# EasyEDA schematic SCH_train-system-design_2026-06-14.json
TITLE: Sheet_2; REV: 1.0; Date: 2026-06-10; Sheet: 1/1; Drawn By: tushar_kherde; Company: Your Company
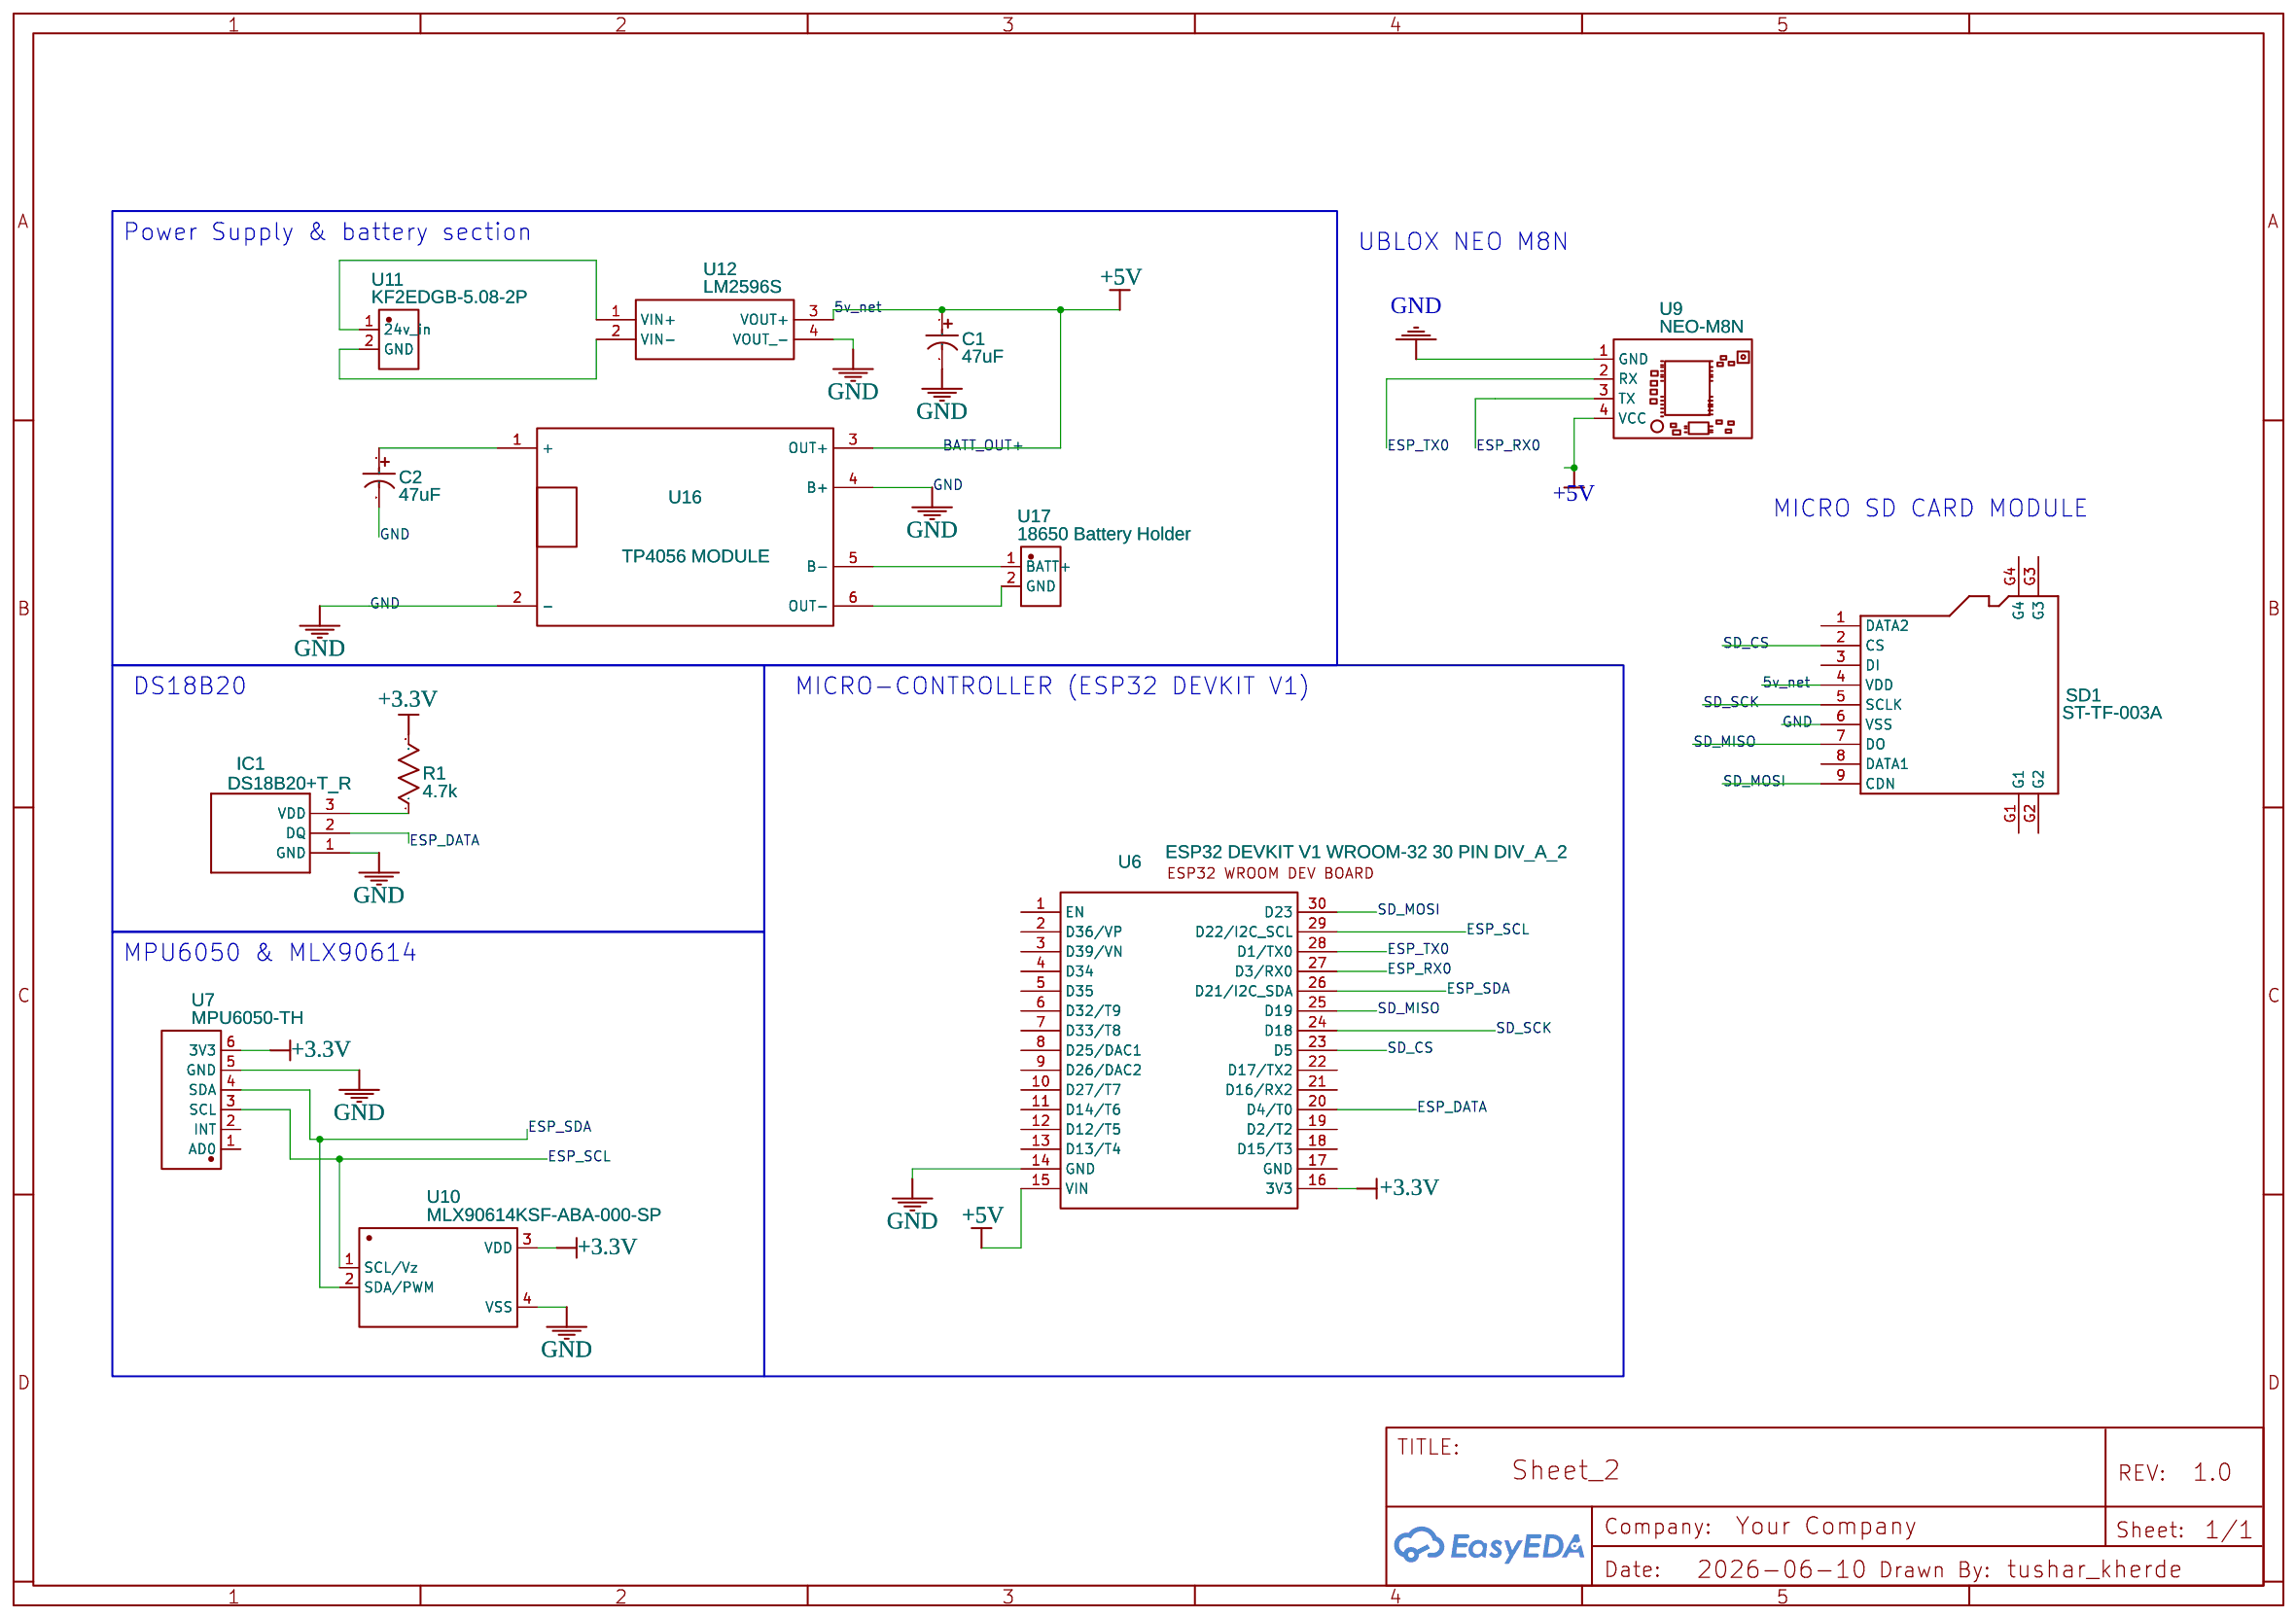
[diagram p0: schematic sheet]

## Parts
C1  47uF  [CAP-TH_BD5.0-P2.00-D0.8-FD]
C2  47uF  [CAP-TH_BD5.0-P2.00-D0.8-FD]
IC1  DS18B20+T_R  [DS18B20TR]
R1  4.7k  [R0603]
SD1  ST-TF-003A  [MICRO-SD9+4P-SMD-16.1X14.5X1.85MM]
U6  ESP32 DEVKIT V1 WROOM-32 30 PIN DIV_A_2  [ESP32 DEVKIT V1 30 PIN]
U7  MPU6050-TH  [COMM-TH_MPU6050-TH]
U9  NEO-M8N  [UBLOX-NEO-M8N]
U10  MLX90614KSF-ABA-000-SP  [TO-39-4_MELEXIS_MLX90614XXA]
U11  KF2EDGB-5.08-2P  [CONN-TH_KF2EDGB-5.08-2P_1]
U12  LM2596S  [LM2596S]
U16  TP4056 MODULE  [TP4056 MODULE LITHIUM BATTERY CHARGING MODULE]
U17  18650 Battery Holder  [HDR-TH_HMT-2.54-1X2PM]

## Library data of the parts
C1 C2 = 47uF 16V Aluminum electrolytic capacitors: Supplier: LCSC; Manufacturer: Chengx(承兴); Manufacturer Part: KM476M016D11RR0VH2FP0; Supplier Part: C22320; JLCPCB Part Class: Extended Part
IC1 = DS18B20+T_R: Contributor: gkatsis
R1 = R_0603_US: Contributor: LCEDA_Lib
SD1 = ST-TF-003A: Micro SD Card Socket
U6 = ESP32 DEVKIT V1 WROOM-32 30 PIN DIV_A_2: Contributor: artem.kopachsh.2002
U7 = MPU6050-TH: Supplier: LCSC; Supplier Part: C9900132629; Manufacturer: null; Contributor: lcsc
U9 = NEO-M8N: Supplier: MAKERLAB; link: https://www.makerlab-electronics.com/products/gy-neo6mv2-neo-6m-ublox-neo-m8n-flight-controller-gps-module?_pos=1&_psq=UBLOX&_ss=e&_v=1.0; Contributor: 2022-104684
U10 = MLX90614KSF-ABA-000-SP: Supplier: LCSC; Supplier Part: C17210263; Manufacturer: Melexis(比利时迈来芯); JLCPCB Part Class: Extended Part; Contributor: lcsc
U11 = KF2EDGB-5.08-2P: Supplier: LCSC; Supplier Part: C6394128; Manufacturer: KEFA(科发); Contributor: lcsc
U12 = LM2596S: Manufacturer: 10Gtek; Manufacturer Part: LM2596S-DC-DC; Supplier Part: B0BCWLFLF6; link: https://www.amazon.com/gp/product/B0BCWLFLF6/ref=ppx_yo_dt_b_search_asin_title?ie=UTF8&th=1; Contributor: bensenjero.adviento
U16 = TP4056 MODULE: Contributor: erangold2008
U17 = HMT-2.54-1*2PM: Supplier: LCSC; Supplier Part: C54620389; Manufacturer: HMTCONN(华明通); Contributor: lcsc; JLCPCB Part Class: Extended Part

## Nets
+3.3V: R1.2 U6.16(3V3) U7.6(3V3) U10.3(VDD)
+5V: C1.1 SD1.4(VDD) U6.15(VIN) U9.4(VCC) U12.3(VOUT+) U16.3(OUT+)
GND: C1.2 C2.2 IC1.1(GND) SD1.6(VSS) U6.14(GND) U7.5(GND) U9.1(GND) U10.4(VSS) U12.4(VOUT -) U16.2(-) U16.4(B+)
ESP_DATA: IC1.2(DQ) U6.20(D4/T0)
ESP_RX0: U6.27(D3/RX0) U9.3(TX)
ESP_SCL: U6.29(D22/I2C SCL) U7.3(SCL) U10.1(SCL/Vz)
ESP_SDA: U6.26(D21/I2C SDA) U7.4(SDA) U10.2(SDA/PWM)
ESP_TX0: U6.28(D1/TX0) U9.2(RX)
SD_CS: SD1.2(CS) U6.23(D5)
SD_MISO: SD1.7(DO) U6.25(D19)
SD_MOSI: SD1.9(CDN) U6.30(D23)
SD_SCK: SD1.5(SCLK) U6.24(D18)
Net-(C2-1): C2.1 U16.1(+)
Net-(IC1-3): IC1.3(VDD) R1.1
Net-(U11-1): U11.1(24v_in) U12.1(VIN+)
Net-(U11-2): U11.2(GND) U12.2(VIN-)
Net-(U16-5): U16.5(B-) U17.1(BATT+)
Net-(U16-6): U16.6(OUT-) U17.2(GND)

Not connected (* = marked no-connect by the designer): SD1 1(DATA2) 3(DI) 8(DATA1) G1 G2 G3 G4; U6 1(EN) 2(D36/VP) 3(D39/VN) 4(D34) 5(D35) 6(D32/T9) 7(D33/T8) 8(D25/DAC1) 9(D26/DAC2) 10(D27/T7) 11(D14/T6) 12(D12/T5) 13(D13/T4) 17(GND) 18(D15/T3) 19(D2/T2) 21(D16/RX2) 22(D17/TX2); U7 1(AD0) 2(INT)

## Notes on the sheet
- Power Supply & battery section
- UBLOX NEO M8N
- MICRO SD CARD MODULE
- DS18B20
- MICRO-CONTROLLER (ESP32 DEVKIT V1)
- MPU6050 & MLX90614
